# EAGLE design Adafruit TXB0104 (EAGLE 6.4)
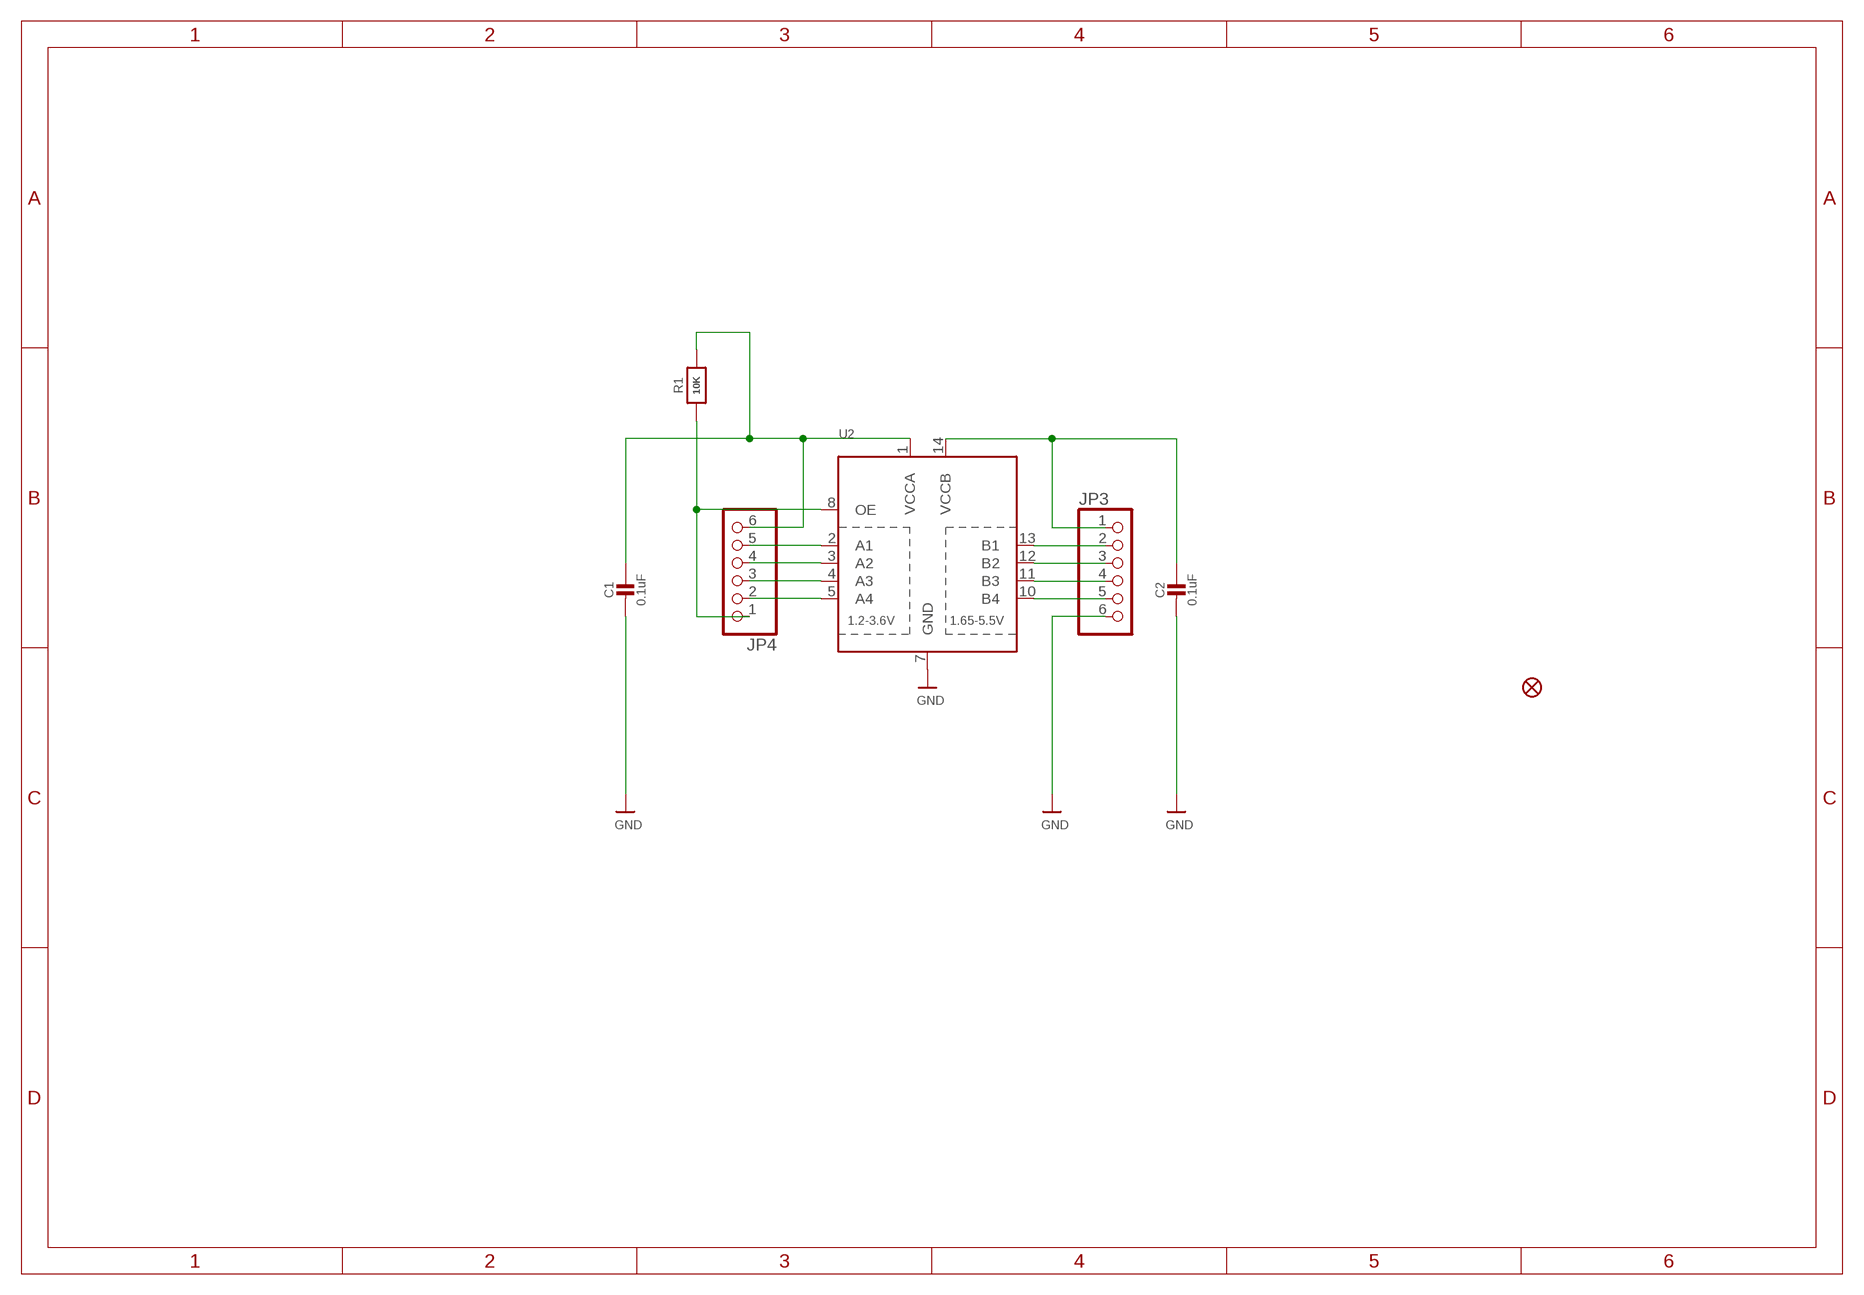
[diagram p0: schematic, sheet 1]

## Parts
C1  0.1uF  CAP_CERAMIC0805-NOOUTLINE  [0805-NO]
C2  0.1uF  CAP_CERAMIC0805-NOOUTLINE  [0805-NO]
JP3  PINHD-1X6CB  [1X06-CLEANBIG]
JP4  PINHD-1X6CB  [1X06-CLEANBIG]
R1  10K  RESISTOR0805_NOOUTLINE  [0805-NO]
U2  TXB0104PWR  [TSSOP14]
U$5  FIDUCIAL_1MM  [FIDUCIAL_1MM]

## Nets
A1: JP4.5 U2.2(A1)
A2: JP4.4 U2.3(A2)
A3: JP4.3 U2.4(A3)
A4: JP4.2 U2.5(A4)
B1: JP3.2 U2.13(B1)
B2: JP3.3 U2.12(B2)
B3: JP3.4 U2.11(B3)
B4: JP3.5 U2.10(B4)
GND: C1.2 C2.2 JP3.6 U2.7(GND)
OE: JP4.1 R1.1 U2.8(OE)
VHIGH: C2.1 JP3.1 U2.14(VCCB)
VLOW: C1.1 JP4.6 R1.2 U2.1(VCCA)

## Library data of the parts
C1 C2 = microbuilder:CAP_CERAMIC: Ceramic Capacitors For new designs, use the packages preceded by an '_' character since they are more reliable: The following footprints should be used on most boards: _0402 - Standard footprint for regular board layouts _0603 - Standard footprint for regular board layouts _0805 - Standard footprint for regular board layouts _1206 - Standard footprint for regular board layouts For extremely tight-pitch boards where space is at a premium, the following 'micro-pitch' footprints can be used (smaller pads, no silkscreen outline, etc.): _0402MP - Micro-pitch footprint for very dense/compact boards _0603MP - Micro-pitch footprint for very dense/compact boards _0805MP - Micro-pitch footprint for very dense/compact boards _1206MP - Micro-pitch footprint for very dense/compact boards
JP3 JP4 = adafruit:PINHD-1X6: PIN HEADER
R1 = microbuilder:RESISTOR: Resistors For new designs, use the packages preceded by an '_' character since they are more reliable: The following footprints should be used on most boards: _0402 - Standard footprint for regular board layouts _0603 - Standard footprint for regular board layouts _0805 - Standard footprint for regular board layouts _1206 - Standard footprint for regular board layouts For extremely tight-pitch boards where space is at a premium, the following 'micro-pitch' footprints can be used (smaller pads, no silkscreen outline, etc.): _0402MP - Micro-pitch footprint for very dense/compact boards _0603MP - Micro-pitch footprint for very dense/compact boards _0805MP - Micro-pitch footprint for very dense/compact boards _1206MP - Micro-pitch footprint for very dense/compact boards
U2 = microbuilder:TXB0104PWR: 4-Bit Bi-Directional Level Shifter 1.2V-3.6V (VCCA) to 1.65V-5.5V (VCCB) bi-directional level shifter with auto direction sensing. Max data rate - VCCA 1.8V: 20Mbps (50ns), VCCA 3.3V: 100Mbps (10ns) Digikey: 296-21929-1-ND NOTE: For cheaper alternative see NXP's NTB0104 (Digikey: 568-8404-1-ND)
U$5 = microbuilder:FIDUCIAL: Fiducial Alignment Points Various fiducial points for machine vision alignment.; BOM: EXCLUDE

## Board
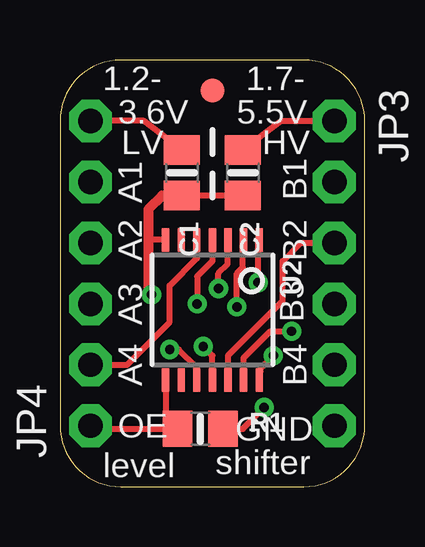
[diagram p1: board, top side]
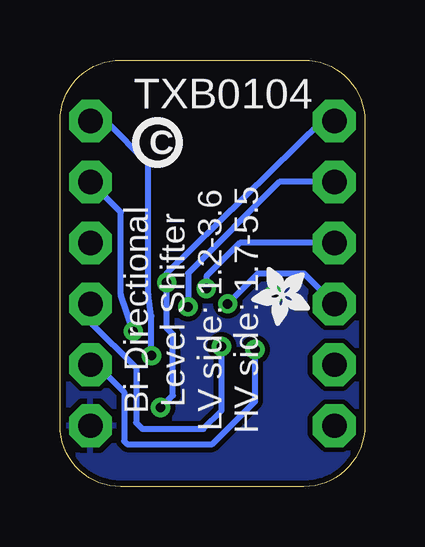
[diagram p2: board, bottom side, seen from below]

Size 12.7 x 17.78 mm. Coordinates in mm from the lower left corner, seen from the top.
Outline: 10.16,17.78 2.54,17.78 arc90 0,15.24 0,2.54 arc90 2.54,0 10.16,0 arc90 12.7,2.54 12.7,15.24 arc90 10.16,17.78
Copper layers (1*16): Top 0.035mm / dielectric 1.5mm / Bottom 0.035mm
Design rules "adafruit": minimum track width 8mil, minimum drill 15.5mil, track to track 8mil, track to pad 8mil, pad to pad 8mil, via to via 8mil, smd to smd 8mil, copper to edge 10mil, drill to drill 8mil, minimum pad ring 10mil, minimum via ring 8mil, stop-mask expansion 2mil, vias tented up to drill 20mil, thermal gap 10mil

### Footprints (pad centres in the part's own frame; a part is rotated, then mirrored left to right if it is on the bottom)
0805-NO = smd 1.24 x 1.5: 1 -0.95,0; 2 0.95,0
1X06-CLEANBIG = drill 1.016 pad 1.778 octagon: 1 -6.35,0; 2 -3.81,0; 3 -1.27,0; 4 1.27,0; 5 3.81,0; 6 6.35,0
TSSOP14 = smd 0.305 x 0.991: 1 -1.95,-2.918; 2 -1.3,-2.918; 3 -0.65,-2.918; 4 0,-2.918; 5 0.65,-2.918; 6 1.3,-2.918; 7 1.95,-2.918; 8 1.95,2.918; 9 1.3,2.918; 10 0.65,2.918; 11 0,2.918; 12 -0.65,2.918; 13 -1.3,2.918; 14 -1.95,2.918
FIDUCIAL_1MM = smd 1 x 1: 1 0,0

### Placement (x,y rotation side)
C1  5.08,13.08 270 top
C2  7.62,13.08 270 top
JP3  11.43,8.89 270 top
JP4  1.27,8.89 90 top
R1  5.84,2.41 0 top
U2  6.35,7.37 180 top
U$4  [ADAFRUIT_2.5MM]  2.29,9.14 180 bottom
U$5  6.35,16.51 0 top
U$7  [PCBFEAT-REV-040]  8.64,14.35 0 bottom

### Tracks (layer width: path | path; a pad name or v marks a point on that pad's centre or on a via)
A1  (via drill 0.39)
  Top 0.254: v7.37,7.49 7.37,8.89 7.62,9.14 7.62,10.25 U2.2
  Bottom 0.254: JP4.5 3.56,12.7 7.37,8.89 v7.37,7.49
A2  (via drill 0.39)
  Top 0.254: v6.6,8.26 6.6,8.89 6.99,9.27 6.99,10.27 U2.3
  Bottom 0.254: JP4.4 5.21,10.16 6.6,8.76 v6.6,8.26
A3  (via drill 0.39)
  Top 0.254: U2.4 6.35,9.4 5.71,8.76 v5.71,7.62
  Bottom 0.254: v5.71,7.62 4.45,8.89 2.54,8.89 JP4.3
A4
  Top 0.254: JP4.2 2.79,5.08 4.57,6.86 4.57,8.38 5.7,9.51 U2.5
B1  (via drill 0.39)
  Top 0.254: U2.13 7.65,5.36 8.76,6.48 v9.65,6.48
  Bottom 0.254: v9.65,6.48 10.16,8 10.16,11.43 JP3.2
B2
  Top 0.254: U2.12 7,5.48 9.27,7.75 9.27,9.4 10.03,10.16 JP3.3
B3  (via drill 0.39)
  Top 0.254: U2.11 6.35,5.46 v5.97,5.84
  Bottom 0.254: JP3.4 11.43,6.86 9.53,4.95 9.53,2.67 9.27,2.41 6.73,2.41 5.97,3.17 v5.97,5.84
B4  (via drill 0.39)
  Top 0.254: U2.10 5.7,4.97 4.95,5.71 v4.57,5.71
  Bottom 0.254: JP3.5 11.05,4.95 10.03,3.94 10.03,1.91 9.91,1.78 6.35,1.78 4.57,3.56 v4.57,5.71
GND  (via drill 0.39)
  Top 0.254: C2.2 C1.2 | U2.7 3.68,10.28 3.68,10.29
  Top 0.406: C1.2 4.26,12.13 3.68,11.56 3.68,10.29 3.68,8.13 v3.81,8
  pour Bottom: -0.38,18.54 -0.38,0 14.35,0 14.35,18.54
OE
  Top 0.254: JP4.1 1.4,2.41 R1.1 4.4,3.03 U2.8
VHIGH  (via drill 0.39)
  Top 0.254: U2.14 8.38,4.96 v8.89,5.46 | C2.1 9.21,15.24 JP3.1
  Bottom 0.254: v8.89,5.46 8.89,7.11 9.02,8 9.02,13.46 10.79,15.24 JP3.1
VLOW  (via drill 0.39)
  Top 0.254: v8.26,8.51 8.26,10.24 U2.1 | C1.1 3.49,15.24 JP4.6 | R1.2 7.62,2.41 v8.51,3.3
  Bottom 0.254: JP4.6 1.78,15.24 8.26,8.89 v8.26,8.51 8.26,6.6 8,6.35 8,3.81 v8.51,3.3

### Text on the board
tPlace: 1.2- | 1.7- | 3.6V | LV | 5.5V | HV | A1 | B1 | A2 | B2 | A3 | B3 | A4 | B4 | GND | OE | shifter | level
bPlace: TXB0104 | Bi-Directional / Level Shifter / LV side: 1.2-3.6 / HV side: 1.7-5.5